# Altium schematic sheet BANK_S_CAPACITORS.SchDoc
size A3; Organization: ICNS, MARCS Institute; Address1: Werrington South Campus, Great Western Highway; Address2: Werrington, NSW, 2747; SheetNumber: 6; SheetTotal: 16
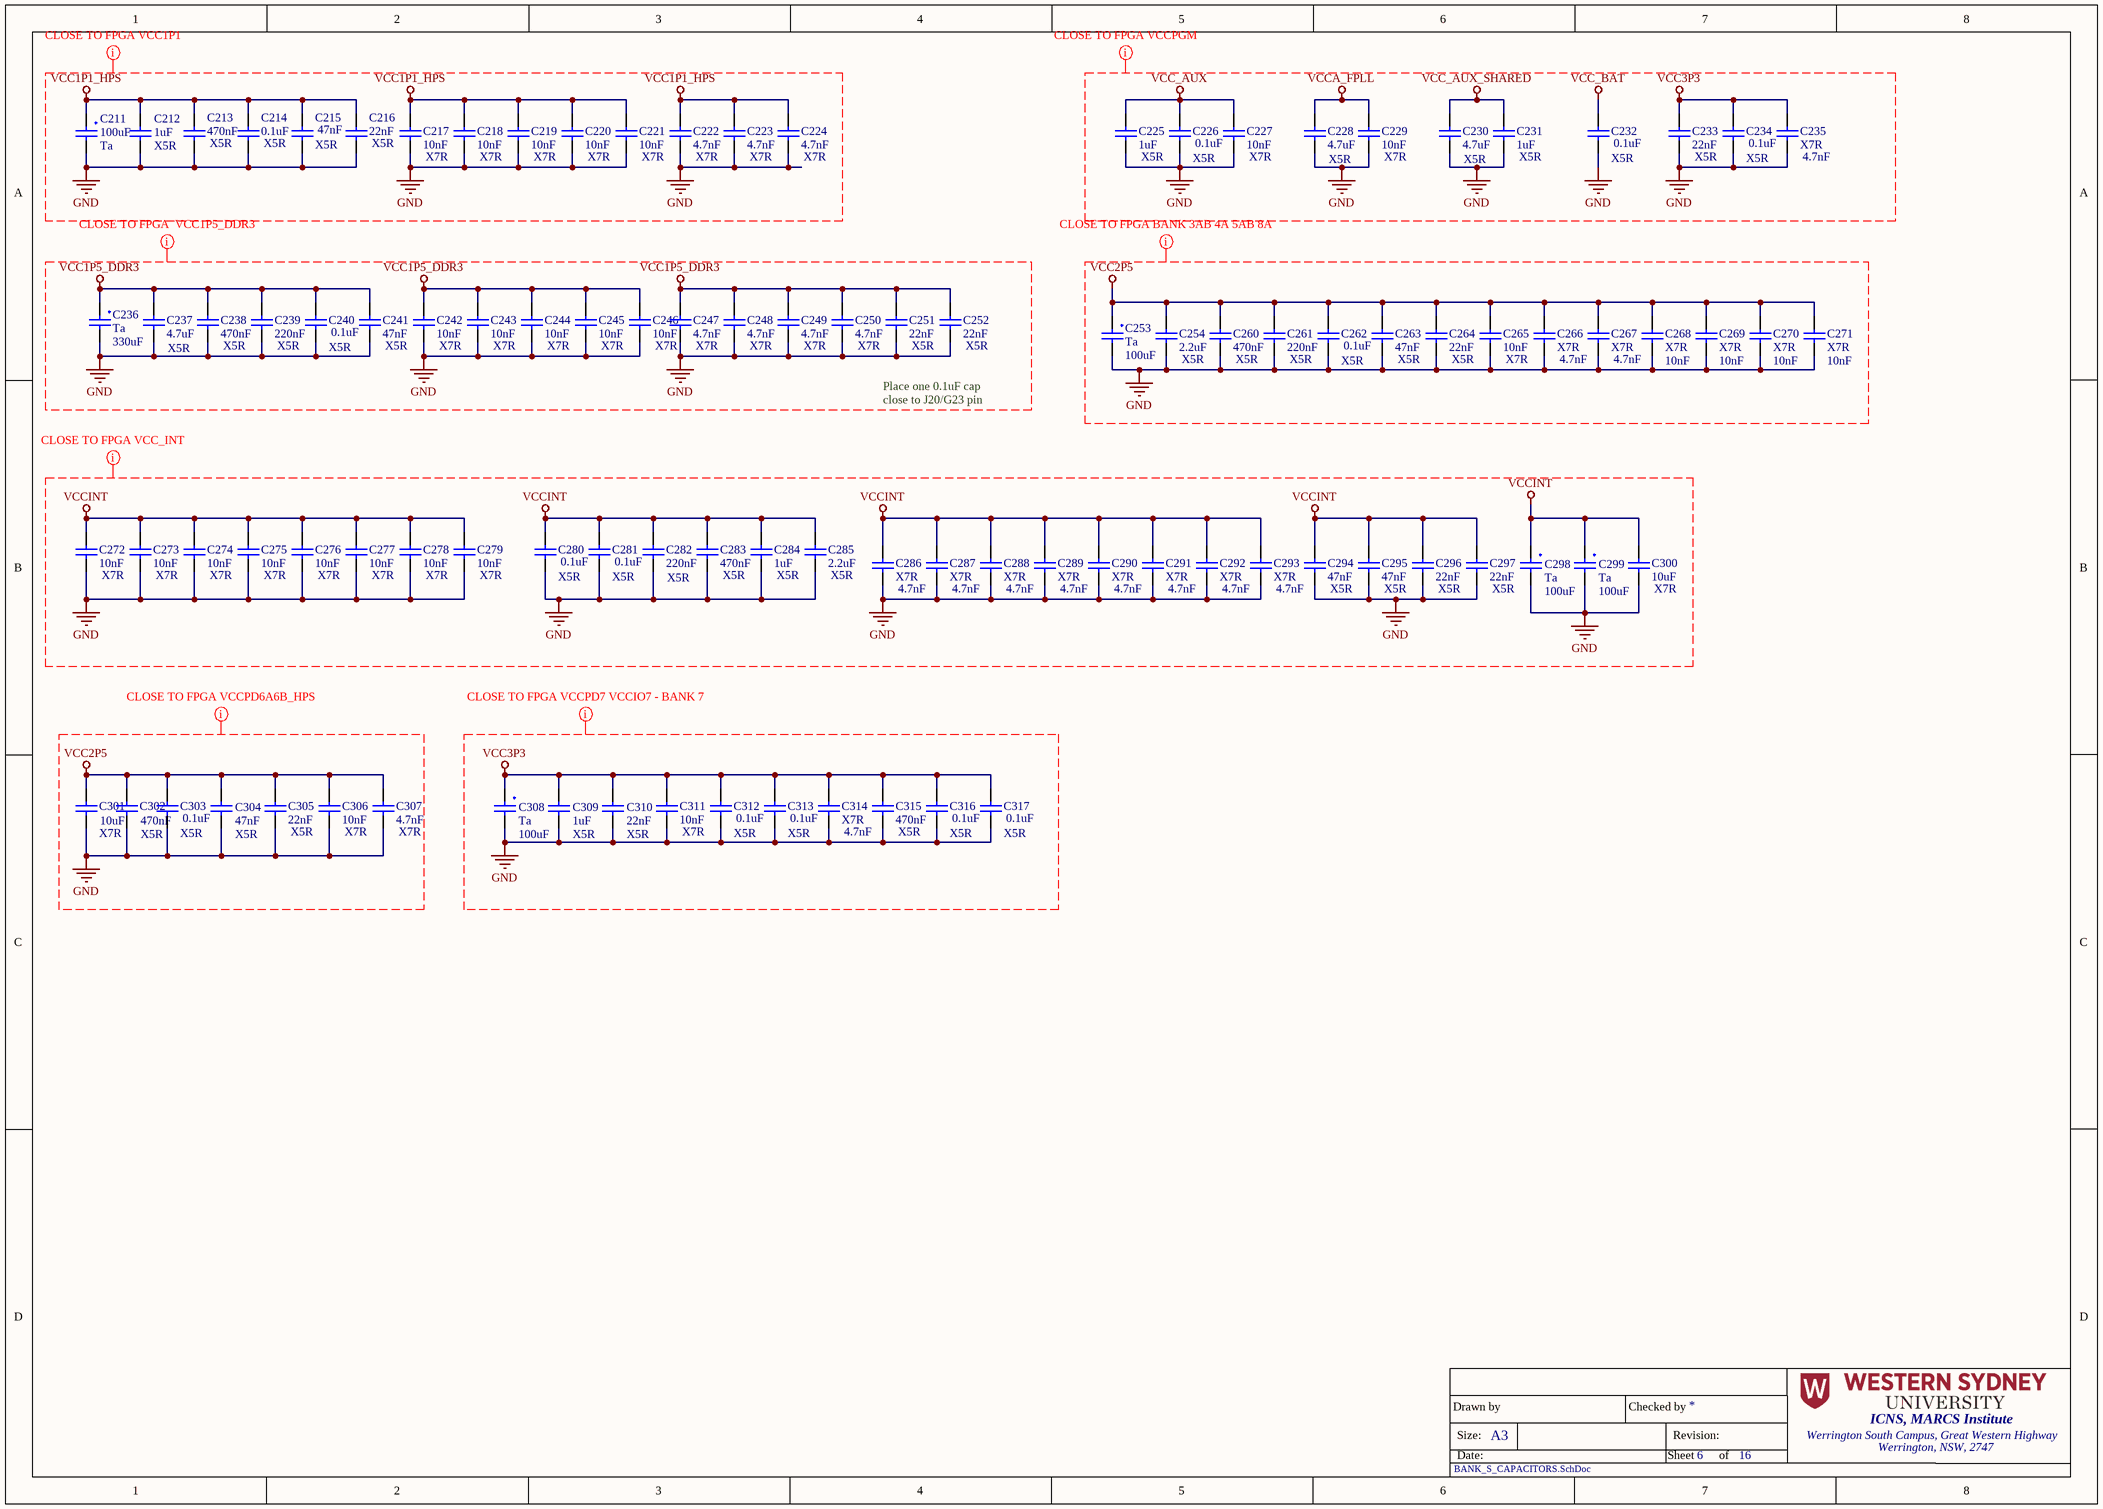
[diagram p0: BANK_S_CAPACITORS.SchDoc]

## Parts
C211  value 100uF  Dielectric: Ta  [CAPCP 0805 (2012)]  (hidden comment: TLCR107M006RTA)
C212  value 1uF  Dielectric: X5R  [CAP 0201 (0603)]  (hidden comment: CL03A105KP3NSNC)
C213  value 470nF  Dielectric: X5R  [CAP 0201 (0603)]  (hidden comment: LMK063BBJ474KPLF)
C214  value 0.1uF  Dielectric: X5R  [CAP 0201 (0603)]  (hidden comment: CL03A104KP3NNNC)
C215  value 47nF  Dielectric: X5R  [CAP 0201 (0603)]  (hidden comment: GRM033R60J473KE19D)
C216  value 22nF  Dielectric: X5R  [CAP 0201 (0603)]  (hidden comment: CC0201KRX5R6BB223)
C217  value 10nF  Dielectric: X7R  [CAP 0201 (0603)]  (hidden comment: GRM033R71A103KA01D)
C218  value 10nF  Dielectric: X7R  [CAP 0201 (0603)]  (hidden comment: GRM033R71A103KA01D)
C219  value 10nF  Dielectric: X7R  [CAP 0201 (0603)]  (hidden comment: GRM033R71A103KA01D)
C220  value 10nF  Dielectric: X7R  [CAP 0201 (0603)]  (hidden comment: GRM033R71A103KA01D)
C221  value 10nF  Dielectric: X7R  [CAP 0201 (0603)]  (hidden comment: GRM033R71A103KA01D)
C222  value 4.7nF  Dielectric: X7R  [CAP 0201 (0603)]  (hidden comment: CC0201KRX7R5BB472)
C223  value 4.7nF  Dielectric: X7R  [CAP 0201 (0603)]  (hidden comment: CC0201KRX7R5BB472)
C224  value 4.7nF  Dielectric: X7R  [CAP 0201 (0603)]  (hidden comment: CC0201KRX7R5BB472)
C225  value 1uF  Dielectric: X5R  [CAP 0201 (0603)]  (hidden comment: CL03A105KP3NSNC)
C226  value 0.1uF  Dielectric: X5R  [CAP 0201 (0603)]  (hidden comment: CL03A104KP3NNNC)
C227  value 10nF  Dielectric: X7R  [CAP 0201 (0603)]  (hidden comment: GRM033R71A103KA01D)
C228  value 4.7uF  Dielectric: X5R  [CAP 0402 (1005)]  (hidden comment: C1005X5R1A475K050BC)
C229  value 10nF  Dielectric: X7R  [CAP 0201 (0603)]  (hidden comment: GRM033R71A103KA01D)
C230  value 4.7uF  Dielectric: X5R  [CAP 0402 (1005)]  (hidden comment: C1005X5R1A475K050BC)
C231  value 1uF  Dielectric: X5R  [CAP 0201 (0603)]  (hidden comment: CL03A105KP3NSNC)
C232  value 0.1uF  Dielectric: X5R  [CAP 0201 (0603)]  (hidden comment: CL03A104KP3NNNC)
C233  value 22nF  Dielectric: X5R  [CAP 0201 (0603)]  (hidden comment: CC0201KRX5R6BB223)
C234  value 0.1uF  Dielectric: X5R  [CAP 0201 (0603)]  (hidden comment: CL03A104KP3NNNC)
C235  Capacitance: 4.7nF  Dielectric: X7R  [CAP 0201 (0603)]  (hidden comment: CC0201KRX7R5BB472)
C236  value 330uF  Dielectric: Ta  [CAPMP7343X31N]  (hidden comment: T495D337K006ATE100)
C237  value 4.7uF  Dielectric: X5R  [CAP 0402 (1005)]  (hidden comment: C1005X5R1A475K050BC)
C238  value 470nF  Dielectric: X5R  [CAP 0201 (0603)]  (hidden comment: LMK063BBJ474KPLF)
C239  value 220nF  Dielectric: X5R  [CAP 0201 (0603)]  (hidden comment: GRM033R61A224KE90D)
C240  value 0.1uF  Dielectric: X5R  [CAP 0201 (0603)]  (hidden comment: CL03A104KP3NNNC)
C241  value 47nF  Dielectric: X5R  [CAP 0201 (0603)]  (hidden comment: GRM033R60J473KE19D)
C242  value 10nF  Dielectric: X7R  [CAP 0201 (0603)]  (hidden comment: GRM033R71A103KA01D)
C243  value 10nF  Dielectric: X7R  [CAP 0201 (0603)]  (hidden comment: GRM033R71A103KA01D)
C244  value 10nF  Dielectric: X7R  [CAP 0201 (0603)]  (hidden comment: GRM033R71A103KA01D)
C245  value 10nF  Dielectric: X7R  [CAP 0201 (0603)]  (hidden comment: GRM033R71A103KA01D)
C246  value 10nF  Dielectric: X7R  [CAP 0201 (0603)]  (hidden comment: GRM033R71A103KA01D)
C247  value 4.7nF  Dielectric: X7R  [CAP 0201 (0603)]  (hidden comment: CC0201KRX7R5BB472)
C248  value 4.7nF  Dielectric: X7R  [CAP 0201 (0603)]  (hidden comment: CC0201KRX7R5BB472)
C249  value 4.7nF  Dielectric: X7R  [CAP 0201 (0603)]  (hidden comment: CC0201KRX7R5BB472)
C250  value 4.7nF  Dielectric: X7R  [CAP 0201 (0603)]  (hidden comment: CC0201KRX7R5BB472)
C251  value 22nF  Dielectric: X5R  [CAP 0201 (0603)]  (hidden comment: CC0201KRX5R6BB223)
C252  value 22nF  Dielectric: X5R  [CAP 0201 (0603)]  (hidden comment: CC0201KRX5R6BB223)
C253  value 100uF  Dielectric: Ta  [CAPCP 0805 (2012)]  (hidden comment: TLCR107M006RTA)
C254  value 2.2uF  Dielectric: X5R  [CAP 0201 (0603)]  (hidden comment: GRM033R61A225KE47J)
C260  value 470nF  Dielectric: X5R  [CAP 0201 (0603)]  (hidden comment: LMK063BBJ474KPLF)
C261  value 220nF  Dielectric: X5R  [CAP 0201 (0603)]  (hidden comment: GRM033R61A224KE90D)
C262  value 0.1uF  Dielectric: X5R  [CAP 0201 (0603)]  (hidden comment: CL03A104KP3NNNC)
C263  value 47nF  Dielectric: X5R  [CAP 0201 (0603)]  (hidden comment: GRM033R60J473KE19D)
C264  value 22nF  Dielectric: X5R  [CAP 0201 (0603)]  (hidden comment: CC0201KRX5R6BB223)
C265  value 10nF  Dielectric: X7R  [CAP 0201 (0603)]  (hidden comment: GRM033R71A103KA01D)
C266  Capacitance: 4.7nF  Dielectric: X7R  [CAP 0201 (0603)]  (hidden comment: CC0201KRX7R5BB472)
C267  Capacitance: 4.7nF  Dielectric: X7R  [CAP 0201 (0603)]  (hidden comment: CC0201KRX7R5BB472)
C268  value 10nF  Dielectric: X7R  [CAP 0201 (0603)]  (hidden comment: GRM033R71A103KA01D)
C269  value 10nF  Dielectric: X7R  [CAP 0201 (0603)]  (hidden comment: GRM033R71A103KA01D)
C270  value 10nF  Dielectric: X7R  [CAP 0201 (0603)]  (hidden comment: GRM033R71A103KA01D)
C271  value 10nF  Dielectric: X7R  [CAP 0201 (0603)]  (hidden comment: GRM033R71A103KA01D)
C272  value 10nF  Dielectric: X7R  [CAP 0201 (0603)]  (hidden comment: GRM033R71A103KA01D)
C273  value 10nF  Dielectric: X7R  [CAP 0201 (0603)]  (hidden comment: GRM033R71A103KA01D)
C274  value 10nF  Dielectric: X7R  [CAP 0201 (0603)]  (hidden comment: GRM033R71A103KA01D)
C275  value 10nF  Dielectric: X7R  [CAP 0201 (0603)]  (hidden comment: GRM033R71A103KA01D)
C276  value 10nF  Dielectric: X7R  [CAP 0201 (0603)]  (hidden comment: GRM033R71A103KA01D)
C277  value 10nF  Dielectric: X7R  [CAP 0201 (0603)]  (hidden comment: GRM033R71A103KA01D)
C278  value 10nF  Dielectric: X7R  [CAP 0201 (0603)]  (hidden comment: GRM033R71A103KA01D)
C279  value 10nF  Dielectric: X7R  [CAP 0201 (0603)]  (hidden comment: GRM033R71A103KA01D)
C280  value 0.1uF  Dielectric: X5R  [CAP 0201 (0603)]  (hidden comment: CL03A104KP3NNNC)
C281  value 0.1uF  Dielectric: X5R  [CAP 0201 (0603)]  (hidden comment: CL03A104KP3NNNC)
C282  value 220nF  Dielectric: X5R  [CAP 0201 (0603)]  (hidden comment: GRM033R61A224KE90D)
C283  value 470nF  Dielectric: X5R  [CAP 0201 (0603)]  (hidden comment: LMK063BBJ474KPLF)
C284  value 1uF  Dielectric: X5R  [CAP 0201 (0603)]  (hidden comment: CL03A105KP3NSNC)
C285  value 2.2uF  Dielectric: X5R  [CAP 0201 (0603)]  (hidden comment: GRM033R61A225KE47J)
C286  Capacitance: 4.7nF  Dielectric: X7R  [CAP 0201 (0603)]  (hidden comment: CC0201KRX7R5BB472)
C287  Capacitance: 4.7nF  Dielectric: X7R  [CAP 0201 (0603)]  (hidden comment: CC0201KRX7R5BB472)
C288  Capacitance: 4.7nF  Dielectric: X7R  [CAP 0201 (0603)]  (hidden comment: CC0201KRX7R5BB472)
C289  Capacitance: 4.7nF  Dielectric: X7R  [CAP 0201 (0603)]  (hidden comment: CC0201KRX7R5BB472)
C290  Capacitance: 4.7nF  Dielectric: X7R  [CAP 0201 (0603)]  (hidden comment: CC0201KRX7R5BB472)
C291  Capacitance: 4.7nF  Dielectric: X7R  [CAP 0201 (0603)]  (hidden comment: CC0201KRX7R5BB472)
C292  Capacitance: 4.7nF  Dielectric: X7R  [CAP 0201 (0603)]  (hidden comment: CC0201KRX7R5BB472)
C293  Capacitance: 4.7nF  Dielectric: X7R  [CAP 0201 (0603)]  (hidden comment: CC0201KRX7R5BB472)
C294  value 47nF  Dielectric: X5R  [CAP 0201 (0603)]  (hidden comment: GRM033R60J473KE19D)
C295  value 47nF  Dielectric: X5R  [CAP 0201 (0603)]  (hidden comment: GRM033R60J473KE19D)
C296  value 22nF  Dielectric: X5R  [CAP 0201 (0603)]  (hidden comment: CC0201KRX5R6BB223)
C297  value 22nF  Dielectric: X5R  [CAP 0201 (0603)]  (hidden comment: CC0201KRX5R6BB223)
C298  value 100uF  Dielectric: Ta  [CAPCP 0805 (2012)]  (hidden comment: TLCR107M006RTA)
C299  value 100uF  Dielectric: Ta  [CAPCP 0805 (2012)]  (hidden comment: TLCR107M006RTA)
C300  value 10uF  Dielectric: X7R  [CAP 0805 (2012)]  (hidden comment: GCM21BR71A106KE22K)
C301  Dielectric: X7R  Capacitance: 10uF  [CAP 0805 (2012)]  (hidden comment: GCM21BR71A106KE22K)
C302  Dielectric: X5R  Capacitance: 470nF  [CAP 0201 (0603)]  (hidden comment: LMK063BBJ474KPLF)
C303  value 0.1uF  Dielectric: X5R  [CAP 0201 (0603)]  (hidden comment: CL03A104KP3NNNC)
C304  value 47nF  Dielectric: X5R  [CAP 0201 (0603)]  (hidden comment: GRM033R60J473KE19D)
C305  value 22nF  Dielectric: X5R  [CAP 0201 (0603)]  (hidden comment: CC0201KRX5R6BB223)
C306  value 10nF  Dielectric: X7R  [CAP 0201 (0603)]  (hidden comment: GRM033R71A103KA01D)
C307  value 4.7nF  Dielectric: X7R  [CAP 0201 (0603)]  (hidden comment: CC0201KRX7R5BB472)
C308  value 100uF  Dielectric: Ta  [CAPCP 0805 (2012)]  (hidden comment: TLCR107M006RTA)
C309  value 1uF  Dielectric: X5R  [CAP 0201 (0603)]  (hidden comment: CL03A105KP3NSNC)
C310  value 22nF  Dielectric: X5R  [CAP 0201 (0603)]  (hidden comment: CC0201KRX5R6BB223)
C311  value 10nF  Dielectric: X7R  [CAP 0201 (0603)]  (hidden comment: GRM033R71A103KA01D)
C312  value 0.1uF  Dielectric: X5R  [CAP 0201 (0603)]  (hidden comment: CL03A104KP3NNNC)
C313  value 0.1uF  Dielectric: X5R  [CAP 0201 (0603)]  (hidden comment: CL03A104KP3NNNC)
C314  Capacitance: 4.7nF  Dielectric: X7R  [CAP 0201 (0603)]  (hidden comment: CC0201KRX7R5BB472)
C315  value 470nF  Dielectric: X5R  [CAP 0201 (0603)]  (hidden comment: LMK063BBJ474KPLF)
C316  value 0.1uF  Dielectric: X5R  [CAP 0201 (0603)]  (hidden comment: CL03A104KP3NNNC)
C317  value 0.1uF  Dielectric: X5R  [CAP 0201 (0603)]  (hidden comment: CL03A104KP3NNNC)

## Nets
GND: C211.2 C212.2 C213.2 C214.2 C215.2 C216.2 C217.2 C218.2 C219.2 C220.2 C221.2 C222.2 C223.2 C224.2 C225.2 C226.2 C227.2 C228.2 C229.2 C230.2 C231.2 C232.2 C233.2 C234.2 C235.2 C236.2 C237.2 C238.2 C239.2 C240.2 C241.2 C242.2 C243.2 C244.2 C245.2 C246.2 C247.2 C248.2 C249.2 C250.2 C251.2 C252.2 C253.2 C254.2 C260.2 C261.2 C262.2 C263.2 C264.2 C265.2 C266.2 C267.2 C268.2 C269.2 C270.2 C271.2 C272.2 C273.2 C274.2 C275.2 C276.2 C277.2 C278.2 C279.2 C280.2 C281.2 C282.2 C283.2 C284.2 C285.2 C286.2 C287.2 C288.2 C289.2 C290.2 C291.2 C292.2 C293.2 C294.2 C295.2 C296.2 C297.2 C298.2 C299.2 C300.2 C301.2 C302.2 C303.2 C304.2 C305.2 C306.2 C307.2 C308.2 C309.2 C310.2 C311.2 C312.2 C313.2 C314.2 C315.2 C316.2 C317.2
VCC1P1_HPS: C211.1 C212.1 C213.1 C214.1 C215.1 C216.1 C217.1 C218.1 C219.1 C220.1 C221.1 C222.1 C223.1 C224.1
VCC1P5_DDR3: C236.1 C237.1 C238.1 C239.1 C240.1 C241.1 C242.1 C243.1 C244.1 C245.1 C246.1 C247.1 C248.1 C249.1 C250.1 C251.1 C252.1
VCC2P5: C253.1 C254.1 C260.1 C261.1 C262.1 C263.1 C264.1 C265.1 C266.1 C267.1 C268.1 C269.1 C270.1 C271.1 C301.1 C302.1 C303.1 C304.1 C305.1 C306.1 C307.1
VCC3P3: C233.1 C234.1 C235.1 C308.1 C309.1 C310.1 C311.1 C312.1 C313.1 C314.1 C315.1 C316.1 C317.1
VCC_AUX: C225.1 C226.1 C227.1
VCC_AUX_SHARED: C230.1 C231.1
VCC_BAT: C232.1
VCCA_FPLL: C228.1 C229.1
VCCINT: C272.1 C273.1 C274.1 C275.1 C276.1 C277.1 C278.1 C279.1 C280.1 C281.1 C282.1 C283.1 C284.1 C285.1 C286.1 C287.1 C288.1 C289.1 C290.1 C291.1 C292.1 C293.1 C294.1 C295.1 C296.1 C297.1 C298.1 C299.1 C300.1

## Layout directives
mark named CLOSE TO FPGA  VCC1P5_DDR3: GND, VCC1P5_DDR3
mark named CLOSE TO FPGA VCC1P1: GND, VCC1P1_HPS
mark named CLOSE TO FPGA VCCPGM: GND, VCC3P3, VCC_AUX, VCC_AUX_SHARED, VCC_BAT, VCCA_FPLL
mark named CLOSE TO FPGA VCC_INT: GND, VCCINT
mark named CLOSE TO FPGA BANK 3AB 4A 5AB 8A: GND, VCC2P5
mark named CLOSE TO FPGA VCCPD6A6B_HPS: GND, VCC2P5
mark named CLOSE TO FPGA VCCPD7 VCCIO7 - BANK 7: GND, VCC3P3

## Notes on the sheet
- Place one 0.1uF cap
  close to J20/G23 pin
- Drawn by
- Size:
- Date:
- A3
- Checked by
- Sheet
- Revision:
- of

## Library data of the parts
C211 = CMP-003-000001-2: Cap Tant Solid 100uF 6.3V R CASE 20% (2 X 1.35 X 1.35mm) SMD 2012-15 5 Ohm 125°C Plastic T/R; Manufacturer 1: Kyocera AVX; Leakage Current: 6uA; ESR (Equivalent Series Resistance): 5R; Width: 0.053inch; Packaging: Tape and Reel; Case Code (Imperial): 0805; Lead Free: Lead Free; Capacitance: 100uF; Features: General Purpose; Package Quantity: 1; RoHS Compliant: Yes; Termination: SMD/SMT; Height - Seated (Max): 0.059inch; Depth: 1.35mm; Max Operating Temperature: 125°C; Series: TLC; Mount: Surface Mount; Voltage Rating: 6.3V; Min Operating Temperature: -55°C; Length: 2mm; Voltage Rating (DC): 6.3V; Radiation Hardening: No; Case/Package: 0805; Construction: Flat; Case Code (Metric): 2012; Tolerance: 20%; Height: 1.5mm; ComponentLink1Description: https://datasheet.ciiva.com/16299/tantniob-16299237.pdf?src-supplier=Future+Electronics; ComponentLink4Description: https://datasheet.ciiva.com/264/tlc-264931.pdf?src-supplier=Digi-Key; ComponentLink2Description: https://datasheet.ciiva.com/17337/tlc-17337857.pdf?src-supplier=Avnet+Europe; Category: Tantalum Capacitors; ComponentLink4URL: https://datasheet.ciiva.com/264/tlc-264931.pdf?src-supplier=Digi-Key; ComponentLink1URL: https://datasheet.ciiva.com/16299/tantniob-16299237.pdf?src-supplier=Future+Electronics; RoHS: Yes; ComponentLink2URL: https://datasheet.ciiva.com/17337/tlc-17337857.pdf?src-supplier=Avnet+Europe; ComponentLink3URL: https://datasheet.ciiva.com/264/tlc-264930.pdf?src-supplier=Digi-Key; Stock 1: 3919; Pricing 1: 1=2.74000, 10=2.21400, 50=1.93200, 100=1.69050, 500=1.28800, 1000=1.12700 (USD); Manufacturer Part Number 1: TLCR107M006RTA; Description 1: Cap Tant Solid 100uF 6.3V R CASE 20% (2 X 1.35 X 1.35mm) SMD 2012-15 5 Ohm 125°C Plastic T/R; Design Item ID: TLCR107M006RTA; Source: ICNS_PropheseeLib.SchLib; ComponentLink3Description: https://datasheet.ciiva.com/264/tlc-264930.pdf?src-supplier=Digi-Key; ComponentLink5URL: https://datasheet.ciiva.com/264/tlc-264932.pdf?src-supplier=Digi-Key; ComponentLink5Description: https://datasheet.ciiva.com/264/tlc-264932.pdf?src-supplier=Digi-Key; ComponentLink6Description: https://datasheet.ciiva.com/12882/tlc-4380-12882614.pdf?src-supplier=Mouser; ComponentLink6URL: https://datasheet.ciiva.com/12882/tlc-4380-12882614.pdf?src-supplier=Mouser
C212 C225 C231 C284 C309 = CMP-003-000015-1: Cap Ceramic 1uF 10V X5R 10% Pad SMD 0201 85C T/R; Manufacturer: Samsung; Capacitance: 1uF; Max Operating Temperature: 85°C; Packaging: Cut Tape; Voltage Rating: 10V; Min Operating Temperature: -55°C; Case/Package: 0201; Tolerance: 10%; Length: 0.024inch; Case Code (Imperial): 0201; Case Code (Metric): 0603; Width: 0.012inch; Mount: Surface Mount; Thickness: 0.013inch; RoHS: Yes; ComponentLink1URL: http://www.samsungsem.com/kr/support/product-search/mlcc/CL03A105KP3NSNC.jsp?src-supplier=Digi-Key; ComponentLink1Description: http://www.samsungsem.com/kr/support/product-search/mlcc/CL03A105KP3NSNC.jsp?src-supplier=Digi-Key; Category: Ceramic Capacitors; Stock 1: 3449211; Source: ICNS_PropheseeLib.SchLib; Pricing 1: 10000=0.06202, 20000=0.05883 (USD); Design Item ID: CL03A105KP3NSNC; Manufacturer Part Number: CL03A105KP3NSNC; RoHS Compliant: Yes
C213 C238 C260 C283 C315 = CMP-003-000027-1: Cap Multilayer Ceramic 0.47 uF 10V X5R  0201 10% RoHS  (High dielectric type); Manufacturer: Taiyo Yuden; Case Code (Imperial): 0201; Voltage Rating (DC): 10V; RoHS Compliant: Yes; Capacitance: 470nF; Pricing 1: 1=0.22500, 25=0.09300, 100=0.07600, 250=0.06500, 500=0.05400, 1000=0.04400 (USD); Manufacturer Part Number: LMK063BBJ474KPLF; RoHS: Yes; Source: ICNS_PropheseeLib.SchLib; ComponentLink1Description: http://www.farnell.com/datasheets/2820091.pdf?src-supplier=Farnell; Design Item ID: LMK063BBJ474KPLF; Category: Ceramic Capacitors; ComponentLink1URL: http://www.farnell.com/datasheets/2820091.pdf?src-supplier=Farnell; Stock 1: 12200
C214 C226 C232 C234 C240 C262 C280 C281 C303 C312 C313 C316 C317 = CMP-003-000014-1: Cap Ceramic 0.1uF 10V X5R 10% Pad SMD 0201 85C T/R; Manufacturer: Samsung; Capacitance: 100nF; Case Code (Imperial): 0201; Voltage Rating (DC): 10V; Manufacturer Part Number: CL03A104KP3NNNC; Stock 1: 12175; Pricing 1: 1=0.10000, 10=0.02900, 50=0.01600, 100=0.01300, 500=0.00932, 1000=0.00732, 2500=0.00666, 5000=0.00612 (USD); ComponentLink1URL: https://datasheet.ciiva.com/25803/cl03a104kp3nnnc-25803204.pdf?src-supplier=Digi-Key; ComponentLink1Description: https://datasheet.ciiva.com/25803/cl03a104kp3nnnc-25803204.pdf?src-supplier=Digi-Key; RoHS: Yes; Source: ICNS_PropheseeLib.SchLib; Design Item ID: CL03A104KP3NNNC; Category: Ceramic Capacitors; Voltage Rating: 10V; Tolerance: 10%; Depth: 0.3mm; Mount: Surface Mount; Package Quantity: 1; Packaging: Tape and Reel; Case Code (Metric): 0603; Lead Free: Lead Free; Width: 0.012inch; Length: 0.6mm; Radiation Hardening: No; Height: 0.3mm; Series: CL; Thickness: 0.013inch; ComponentLink2Description: https://datasheet.ciiva.com/26838/getdatasheetpartid-357484-26838083.pdf?src-supplier=Verical; Max Operating Temperature: 85°C; ComponentLink2URL: https://datasheet.ciiva.com/26838/getdatasheetpartid-357484-26838083.pdf?src-supplier=Verical; Case/Package: 0201; Contact Plating: Tin; Min Operating Temperature: -55°C; Construction: Flat
C215 C241 C263 C294 C295 C304 = CMP-003-000019-1: Cap Multilayer Ceramic 47nF 6.3V X5R SMT 0201±10% Tolerance; Manufacturer: Murata; Tolerance: 10%; Capacitance: 47nF; ComponentLink2URL: https://datasheet.ciiva.com/18184/getdatasheetpartid-223883-18184048.pdf?src-supplier=Verical; Category: Ceramic Capacitors; Voltage Rating: 6.3V; Lead Free: Lead Free; Height: 0.3mm; ComponentLink2Description: https://datasheet.ciiva.com/18184/getdatasheetpartid-223883-18184048.pdf?src-supplier=Verical; RoHS: Yes; Manufacturer Part Number: GRM033R60J473KE19D; Case Code (Imperial): 0201; Source: ICNS_PropheseeLib.SchLib; Depth: 0.3mm; Mount: Surface Mount; Stock 1: 134562; Package Quantity: 15000; Packaging: Tape and Reel; ComponentLink1Description: https://datasheet.ciiva.com/6270/product-6270930.pdf?src-supplier=Digi-Key; Case Code (Metric): 0603; Width: 0.012inch; Length: 0.6mm; Radiation Hardening: No; Series: GRM; Thickness: 0.013inch; Max Operating Temperature: 85°C; Design Item ID: GRM033R60J473KE19D; Voltage Rating (DC): 6.3V; Case/Package: 0201; Min Operating Temperature: -55°C; Construction: Flat; Pricing 1: 1=0.10000, 10=0.05900, 50=0.03240, 100=0.02640, 500=0.01886, 1000=0.01482, 2500=0.01348, 5000=0.01240 (USD); ComponentLink1URL: https://datasheet.ciiva.com/6270/product-6270930.pdf?src-supplier=Digi-Key; ComponentLink3URL: https://datasheet.ciiva.com/29199/455678-da-01-en-vs-kondensator-0201-29199271.pdf?src-supplier=Conrad; RoHS Compliant: Yes; REACH SVHC: No SVHC; ComponentLink3Description: https://datasheet.ciiva.com/29199/455678-da-01-en-vs-kondensator-0201-29199271.pdf?src-supplier=Conrad; Material: Ceramic; Termination: SMD/SMT
C216 C233 C251 C252 C264 C296 C297 C305 C310 = CMP-003-000017-2: Cap Multilayer Ceramic 22nF 10V X5R 0201 ±10% Tolerance; Manufacturer: Yageo; Width: 0.012inch; Mount: Surface Mount; Capacitance: 22nF; Voltage Rating (DC): 10V; Voltage Rating: 10V; Length: 0.024inch; Packaging: Tape and Reel; Case/Package: 0201; Tolerance: 10%; Min Operating Temperature: -55°C; Lead Free: Lead Free; Thickness: 0.013inch; Max Operating Temperature: 85°C; Design Item ID: CC0201KRX5R6BB223; Stock 1: 314711; Source: ICNS_PropheseeLib.SchLib; ComponentLink1URL: http://www.yageo.com/exep/pages/download/literatures/ProductSelectionGuide%202014_Final_2.pdf?src-supplier=Digi-Key; RoHS: Yes; RoHS Compliant: Yes; Pricing 1: 1=0.10000, 10=0.02400, 50=0.01320, 100=0.01080, 500=0.00770, 1000=0.00605, 2500=0.00550, 5000=0.00506 (USD); Manufacturer Part Number: CC0201KRX5R6BB223; ComponentLink1Description: http://www.yageo.com/exep/pages/download/literatures/ProductSelectionGuide%202014_Final_2.pdf?src-supplier=Digi-Key; Category: Ceramic Capacitors; Case Code Imperial: 0201; Halogen Free: Halogen Free
C217-C221 C227 C229 C242-C246 C265 C268-C279 C306 C311 = CMP-003-000022-2: Cap Multilayer Ceramic 10nF 10V X7R 0201 ±10 % Tolerance SMT; Manufacturer: Murata; Tolerance: 10%; Package Quantity: 1; Width: 0.012inch; Voltage: 10V; Mount: Surface Mount; Capacitance: 10nF; Voltage Rating (DC): 10V; Voltage Rating: 10V; Length: 0.6mm; Packaging: Tape and Reel; Material: Ceramic; REACH SVHC: No SVHC; Termination: SMD/SMT; Case/Package: 0201; Radiation Hardening: No; Height: 0.3mm; Case Code (Imperial): 0201; Min Operating Temperature: -55°C; Lead Free: Lead Free; Thickness: 0.013inch; Depth: 0.3mm; Case Code (Metric): 0603; Max Operating Temperature: 125°C; Design Item ID: GRM033R71A103KA01D; ComponentLink3URL: https://datasheet.ciiva.com/11789/0900766b80ef921d-11789049.pdf?src-supplier=RSComponents; Stock 1: 6245; ComponentLink2URL: https://datasheet.ciiva.com/129/grm033r71a103ka01-01-129815.pdf?src-supplier=Digi-Key; Source: ICNS_PropheseeLib.SchLib; ComponentLink1URL: https://datasheet.ciiva.com/129/grm033r71a103ka01-01-129814.pdf?src-supplier=Digi-Key; ComponentLink4URL: https://datasheet.ciiva.com/16467/product-16467346.pdf?src-supplier=Future+Electronics; RoHS: Yes; RoHS Compliant: Yes; ComponentLink3Description: https://datasheet.ciiva.com/11789/0900766b80ef921d-11789049.pdf?src-supplier=RSComponents; ComponentLink5URL: https://datasheet.ciiva.com/18184/getdatasheetpartid-158821-18184066.pdf?src-supplier=Verical; ComponentLink7Description: https://datasheet.ciiva.com/5422/product-5422667.pdf?src-supplier=Mouser; Pricing 1: 1=0.10000, 10=0.02000, 50=0.01060, 100=0.00870, 500=0.00624, 1000=0.00490, 2500=0.00446, 5000=0.00410 (USD); Manufacturer Part Number: GRM033R71A103KA01D; ComponentLink1Description: https://datasheet.ciiva.com/129/grm033r71a103ka01-01-129814.pdf?src-supplier=Digi-Key; ComponentLink5Description: https://datasheet.ciiva.com/18184/getdatasheetpartid-158821-18184066.pdf?src-supplier=Verical; ComponentLink7URL: https://datasheet.ciiva.com/5422/product-5422667.pdf?src-supplier=Mouser; ComponentLink2Description: https://datasheet.ciiva.com/129/grm033r71a103ka01-01-129815.pdf?src-supplier=Digi-Key; Category: Ceramic Capacitors; ComponentLink6URL: https://datasheet.ciiva.com/29199/455719-da-01-en-vs-kondensator-0201-29199284.pdf?src-supplier=Conrad; ComponentLink4Description: https://datasheet.ciiva.com/16467/product-16467346.pdf?src-supplier=Future+Electronics; ComponentLink6Description: https://datasheet.ciiva.com/29199/455719-da-01-en-vs-kondensator-0201-29199284.pdf?src-supplier=Conrad
C222-C224 C235 C247-C250 C266 C267 C286-C293 C307 C314 = CMP-003-000018-1: Cap Ceramic 4.7nF 6.3V X7R 10% Pad SMD 0201 125C Automotive T/R; Manufacturer: Yageo; Package Quantity: 1; Width: 0.012inch; Mount: Surface Mount; Voltage Rating (DC): 6.3V; Voltage Rating: 6.3V; Length: 0.024inch; Packaging: Tape and Reel; Termination: SMD/SMT; Case/Package: 0201; Tolerance: 10%; Case Code (Imperial): 0201; Min Operating Temperature: -55°C; Lead Free: Lead Free; Thickness: 0.013inch; Case Code (Metric): 0603; Max Operating Temperature: 125°C; Design Item ID: CC0201KRX7R5BB472; ComponentLink3URL: https://datasheet.ciiva.com/176/mlccorderingcode-176531.pdf?src-supplier=Digi-Key; Stock 1: 3450; ComponentLink2URL: https://datasheet.ciiva.com/176/mlccorderingcode-176533.pdf?src-supplier=Digi-Key; Source: ICNS_PropheseeLib.SchLib; ComponentLink1URL: https://datasheet.ciiva.com/176/mlccorderingcode-176532.pdf?src-supplier=Digi-Key; RoHS: Yes; RoHS Compliant: Yes; ComponentLink3Description: https://datasheet.ciiva.com/176/mlccorderingcode-176531.pdf?src-supplier=Digi-Key; Pricing 1: 1=0.10000, 10=0.02400, 50=0.01320, 100=0.01080, 500=0.00770, 1000=0.00605, 2500=0.00550, 5000=0.00506 (USD); Manufacturer Part Number: CC0201KRX7R5BB472; ComponentLink1Description: https://datasheet.ciiva.com/176/mlccorderingcode-176532.pdf?src-supplier=Digi-Key; ComponentLink2Description: https://datasheet.ciiva.com/176/mlccorderingcode-176533.pdf?src-supplier=Digi-Key; Category: Ceramic Capacitors; Series: CC; Resistor Type: Ceramic; Halogen Free: Halogen Free; Weight: 6E-06oz
  C222-C224 C247-C250 C307: Capacitance: 4.7nF
  C235 C266 C267 C286-C293 C314: Value: 4.7nF
C228 C230 C237 = CMP-003-000024-1: Cap Multilayer Ceramic 4.7uF 10 V X5R ±10 % SMT 0402  C Series; Manufacturer: TDK; Voltage Rating: 10V; Tolerance: 10%; Capacitance: 4.7uF; Max Operating Temperature: 85°C; Packaging: Cut Tape; Min Operating Temperature: -55°C; Case/Package: 0402; Voltage Rating (DC): 10V; Length: 0.039inch; Case Code (Imperial): 0402; Case Code (Metric): 1005; Width: 0.02inch; Mount: Surface Mount; Thickness: 0.022inch; Package Quantity: 10000; RoHS: Yes; ComponentLink1URL: https://datasheet.ciiva.com/14895/tdkmlcccaprange-14895670.pdf?src-supplier=Digi-Key; ComponentLink3Description: https://datasheet.ciiva.com/14895/tdkmlcccaprange-14895672.pdf?src-supplier=Digi-Key; REACH SVHC: No SVHC; Lead Free: Lead Free; ComponentLink1Description: https://datasheet.ciiva.com/14895/tdkmlcccaprange-14895670.pdf?src-supplier=Digi-Key; Category: Ceramic Capacitors; Series: C; ComponentLink2Description: https://datasheet.ciiva.com/14895/tdkmlcccaprange-14895671.pdf?src-supplier=Digi-Key; ComponentLink3URL: https://datasheet.ciiva.com/14895/tdkmlcccaprange-14895672.pdf?src-supplier=Digi-Key; Stock 1: 490145; Source: ICNS_PropheseeLib.SchLib; Pricing 1: 1=0.48000, 10=0.33000, 50=0.23100, 100=0.19800, 500=0.14850, 1000=0.12540, 2500=0.11880, 5000=0.11220 (USD); Design Item ID: C1005X5R1A475K050BC; Dielectric Material: Ceramic; Manufacturer Part Number: C1005X5R1A475K050BC; ComponentLink2URL: https://datasheet.ciiva.com/14895/tdkmlcccaprange-14895671.pdf?src-supplier=Digi-Key
C236 = CMP-003-000008-1: Cap Tant Solid 330uF 6.3V D CASE 10% (7.3 X 4.3 X 2.8mm) SMD 7343-31 0.1 Ohm 125 C T/R; Manufacturer 1: KEMET; Polarity: Polar; Dielectric Material: Tantalum; Dissipation Factor: 8%; Leakage Current: 20.8uA; Life (Hours): 2000Hour; Ripple Current: 490mA; ESR (Equivalent Series Resistance): 100mR; Tolerance: 20%; Width: 0.169inch; Packaging: Tape and Reel; Number of Pins: 2; Case Code (Imperial): 2917; Lead Free: Lead Free; Capacitance: 330uF; Features: General Purpose; REACH SVHC: No SVHC; Package Quantity: 1; RoHS Compliant: Yes; Termination: SMD/SMT; Height - Seated (Max): 0.122inch; Voltage: 6.3V; Depth: 4.3mm; Max Operating Temperature: 125°C; Series: T495; Mount: Surface Mount,PCB; Voltage Rating: 6.3V; Min Operating Temperature: -55°C; Length: 7.3mm; Voltage Rating (DC): 6.3V; Lead Pitch: 3.8mm; Radiation Hardening: No; Case/Package: 7343-31; Construction: Flat; Case Code (Metric): 7343; Height: 2.8mm; ComponentLink1Description: https://datasheet.ciiva.com/3006/kem-t2009-t495-3006066.pdf?src-supplier=Avnet; ComponentLink4Description: https://datasheet.ciiva.com/22698/1881875-22698950.pdf?src-supplier=Element14; ComponentLink2Description: https://datasheet.ciiva.com/18096/getdatasheetpartid-131544-18096133.pdf?src-supplier=Verical; Category: Tantalum Capacitors; ComponentLink4URL: https://datasheet.ciiva.com/22698/1881875-22698950.pdf?src-supplier=Element14; ComponentLink1URL: https://datasheet.ciiva.com/3006/kem-t2009-t495-3006066.pdf?src-supplier=Avnet; RoHS: Yes; ComponentLink2URL: https://datasheet.ciiva.com/18096/getdatasheetpartid-131544-18096133.pdf?src-supplier=Verical; ComponentLink3URL: https://datasheet.ciiva.com/14603/70095916-14603941.pdf?src-supplier=Allied+Electronics; Stock 1: 2500; Pricing 1: 1=2.57000, 10=2.07900, 50=1.81480, 100=1.58790 (USD); Manufacturer Part Number 1: T495D337K006ATE100; Description 1: Cap Tant Solid 330uF 6.3V D CASE 10% (7.3 X 4.3 X 2.8mm) SMD 7343-31 0.1 Ohm 125 C T/R; Design Item ID: T495D337K006ATE100; Source: ICNS_PropheseeLib.SchLib; ComponentLink3Description: https://datasheet.ciiva.com/14603/70095916-14603941.pdf?src-supplier=Allied+Electronics
C239 C261 C282 = CMP-003-000020-1: Cap Multilayer Ceramic 220nF 10V X5R 0201 ±10% Tolerance; Manufacturer: Murata; Case Code (Imperial): 0201; Voltage Rating (DC): 10V; RoHS Compliant: Yes; Capacitance: 220nF; Manufacturer Part Number: GRM033R61A224KE90D; Stock 1: 391; Pricing 1: 1=0.10000, 10=0.03600, 50=0.01980, 100=0.01620, 500=0.01156, 1000=0.00908, 2500=0.00825, 5000=0.00759 (USD); ComponentLink1URL: http://www.farnell.com/datasheets/2867835.pdf?src-supplier=Farnell; ComponentLink1Description: http://www.farnell.com/datasheets/2867835.pdf?src-supplier=Farnell; RoHS: Yes; Source: ICNS_PropheseeLib.SchLib; Design Item ID: GRM033R61A224KE90D; Category: Ceramic Capacitors; Voltage Rating: 10V; ComponentLink2Description: http://www.mouser.com/ds/2/281/c02e-2905.pdf?src-supplier=Mouser; ComponentLink3URL: http://search.murata.co.jp/Ceramy/image/img/A01X/G101/ENG/GRM033R61A224KE90-01.pdf?src-supplier=Digi-Key; Thickness: 0.013inch; Width: 0.012inch; ComponentLink2URL: http://www.mouser.com/ds/2/281/c02e-2905.pdf?src-supplier=Mouser; Case/Package: 0201; ComponentLink4Description: http://www.farnell.com/datasheets/2867835.pdf?src-supplier=Newark; Length: 0.024inch; ComponentLink3Description: http://search.murata.co.jp/Ceramy/image/img/A01X/G101/ENG/GRM033R61A224KE90-01.pdf?src-supplier=Digi-Key; Case Code (Metric): 0603; Tolerance: 10%; Packaging: Tape and Reel; Max Operating Temperature: 85°C; Min Operating Temperature: -55°C; ComponentLink4URL: http://www.farnell.com/datasheets/2867835.pdf?src-supplier=Newark; Mount: Surface Mount
C253 C298 C299 C308 = CMP-003-000001-2: Cap Tant Solid 100uF 6.3V R CASE 20% (2 X 1.35 X 1.35mm) SMD 2012-15 5 Ohm 125°C Plastic T/R; Manufacturer 1: Kyocera AVX; ESR (Equivalent Series Resistance): 5R; Leakage Current: 6uA; Construction: Flat; Length: 2mm; Case/Package: 0805; Voltage Rating (DC): 6.3V; Series: TLC; Max Operating Temperature: 125°C; Tolerance: 20%; Min Operating Temperature: -55°C; Mount: Surface Mount; Width: 0.053inch; Depth: 1.35mm; Case Code (Imperial): 0805; Termination: SMD/SMT; Features: General Purpose; Voltage Rating: 6.3V; Case Code (Metric): 2012; Radiation Hardening: No; Capacitance: 100uF; Package Quantity: 1; RoHS Compliant: Yes; Height: 1.5mm; Packaging: Tape and Reel; Height - Seated (Max): 0.059inch; ComponentLink5URL: https://datasheet.ciiva.com/264/tlc-264932.pdf?src-supplier=Digi-Key; ComponentLink5Description: https://datasheet.ciiva.com/264/tlc-264932.pdf?src-supplier=Digi-Key; ComponentLink1Description: https://datasheet.ciiva.com/16299/tantniob-16299237.pdf?src-supplier=Future+Electronics; ComponentLink3Description: https://datasheet.ciiva.com/264/tlc-264930.pdf?src-supplier=Digi-Key; Stock 1: 3919; ComponentLink4URL: https://datasheet.ciiva.com/264/tlc-264931.pdf?src-supplier=Digi-Key; Pricing 1: 1=2.74000, 10=2.21400, 50=1.93200, 100=1.69050, 500=1.28800, 1000=1.12700 (USD); ComponentLink2Description: https://datasheet.ciiva.com/17337/tlc-17337857.pdf?src-supplier=Avnet+Europe; ComponentLink3URL: https://datasheet.ciiva.com/264/tlc-264930.pdf?src-supplier=Digi-Key; RoHS: Yes; ComponentLink4Description: https://datasheet.ciiva.com/264/tlc-264931.pdf?src-supplier=Digi-Key; Manufacturer Part Number 1: TLCR107M006RTA; Source: ICNS_PropheseeLib.SchLib; ComponentLink6Description: https://datasheet.ciiva.com/12882/tlc-4380-12882614.pdf?src-supplier=Mouser; Description 1: Cap Tant Solid 100uF 6.3V R CASE 20% (2 X 1.35 X 1.35mm) SMD 2012-15 5 Ohm 125°C Plastic T/R; Lead Free: Lead Free; ComponentLink1URL: https://datasheet.ciiva.com/16299/tantniob-16299237.pdf?src-supplier=Future+Electronics; Category: Tantalum Capacitors; ComponentLink2URL: https://datasheet.ciiva.com/17337/tlc-17337857.pdf?src-supplier=Avnet+Europe; ComponentLink6URL: https://datasheet.ciiva.com/12882/tlc-4380-12882614.pdf?src-supplier=Mouser; Design Item ID: TLCR107M006RTA
C254 C285 = CMP-003-000021-1: Cap Ceramic 2.2uF 10VDC X5R 10% SMD 0201 Paper T/R  Monolithic; Manufacturer: Murata; Voltage Rating: 10V; Capacitance: 2.2uF; ComponentLink1URL: https://search.murata.co.jp/Ceramy/image/img/A01X/G101/ENG/GRM033R61A225KE47-04A.pdf?src-supplier=Digi-Key; Case Code Imperial: 0201; Source: ICNS_PropheseeLib.SchLib; Pricing 1: 1=0.29000, 10=0.20000, 50=0.11980, 100=0.10120, 500=0.06922, 1000=0.06123, 2500=0.05856, 5000=0.05324 (USD); RoHS: Yes; Manufacturer Part Number: GRM033R61A225KE47J; Design Item ID: GRM033R61A225KE47J; Category: Ceramic Capacitors; ComponentLink1Description: https://search.murata.co.jp/Ceramy/image/img/A01X/G101/ENG/GRM033R61A225KE47-04A.pdf?src-supplier=Digi-Key; Stock 1: 25152; RoHS Compliant: Yes
C300 = CMP-003-000011-1: 0805 10 uF 10 V ±10 % Tolerance X7R Surface Mount Multilayer Ceramic Capacitor; Manufacturer: Murata; Tolerance: 10%; Voltage Rating: 10V; Mount: Surface Mount; Capacitance: 10uF; Width: 1.25mm; Length: 0.079inch; Case Code (Imperial): 0805; Voltage Rating (DC): 10V; Max Operating Temperature: 125°C; Thickness: 0.055inch; Min Operating Temperature: -55°C; Packaging: Tape and Reel; Case/Package: 0805; Case Code (Metric): 2012; Category: Ceramic Capacitors; Height: 1.25mm; Design Item ID: GCM21BR71A106KE22K; Ratings: AEC-Q200; RoHS: Yes; ComponentLink3URL: http://search.murata.co.jp/Ceramy/image/img/A01X/partnumbering_e_02.pdf?src-supplier=Digi-Key; Weight: 0.000335oz; Package Quantity: 10000; ComponentLink4Description: http://search.murata.co.jp/Ceramy/image/img/A01X/G101/ENG/GCM21BR71A106KE22-01.pdf?src-supplier=Digi-Key; RoHS Compliant: Yes; Manufacturer Part Number: GCM21BR71A106KE22K; ComponentLink1URL: http://www.mouser.com/ds/2/281/c03e-806517.pdf?src-supplier=Mouser; ComponentLink1Description: http://www.mouser.com/ds/2/281/c03e-806517.pdf?src-supplier=Mouser; ComponentLink2Description: https://search.murata.co.jp/Ceramy/image/img/A01X/G101/ENG/GCM21BR71A106KE22-01.pdf?src-supplier=Digi-Key; ComponentLink2URL: https://search.murata.co.jp/Ceramy/image/img/A01X/G101/ENG/GCM21BR71A106KE22-01.pdf?src-supplier=Digi-Key; Source: ICNS_PropheseeLib.SchLib; Pricing: 1=0.45000, 10=0.31600, 50=0.23880, 100=0.20790, 500=0.15400, 1000=0.13090, 2500=0.12320, 5000=0.11550 (USD); Stock: 4655; ComponentLink4URL: http://search.murata.co.jp/Ceramy/image/img/A01X/G101/ENG/GCM21BR71A106KE22-01.pdf?src-supplier=Digi-Key; Termination: SMD/SMT; ComponentLink3Description: http://search.murata.co.jp/Ceramy/image/img/A01X/partnumbering_e_02.pdf?src-supplier=Digi-Key
C301 = CMP-003-000011-1: 0805 10 uF 10 V ±10 % Tolerance X7R Surface Mount Multilayer Ceramic Capacitor; Manufacturer: Murata; Voltage Rating: 10V; Value: 10uF; Tolerance: 10%; Case Code (Imperial): 0805; Category: Ceramic Capacitors; Height: 1.25mm; Mount: Surface Mount; Design Item ID: GCM21BR71A106KE22K; Voltage Rating (DC): 10V; Case Code (Metric): 2012; Ratings: AEC-Q200; RoHS: Yes; Case/Package: 0805; ComponentLink3URL: http://search.murata.co.jp/Ceramy/image/img/A01X/partnumbering_e_02.pdf?src-supplier=Digi-Key; Weight: 0.000335oz; Package Quantity: 10000; ComponentLink4Description: http://search.murata.co.jp/Ceramy/image/img/A01X/G101/ENG/GCM21BR71A106KE22-01.pdf?src-supplier=Digi-Key; Max Operating Temperature: 125°C; RoHS Compliant: Yes; Thickness: 0.055inch; Manufacturer Part Number: GCM21BR71A106KE22K; Packaging: Tape and Reel; Width: 1.25mm; ComponentLink1URL: http://www.mouser.com/ds/2/281/c03e-806517.pdf?src-supplier=Mouser; ComponentLink1Description: http://www.mouser.com/ds/2/281/c03e-806517.pdf?src-supplier=Mouser; ComponentLink2Description: https://search.murata.co.jp/Ceramy/image/img/A01X/G101/ENG/GCM21BR71A106KE22-01.pdf?src-supplier=Digi-Key; ComponentLink2URL: https://search.murata.co.jp/Ceramy/image/img/A01X/G101/ENG/GCM21BR71A106KE22-01.pdf?src-supplier=Digi-Key; Source: ICNS_PropheseeLib.SchLib; Pricing: 1=0.45000, 10=0.31600, 50=0.23880, 100=0.20790, 500=0.15400, 1000=0.13090, 2500=0.12320, 5000=0.11550 (USD); Length: 0.079inch; Stock: 4655; ComponentLink4URL: http://search.murata.co.jp/Ceramy/image/img/A01X/G101/ENG/GCM21BR71A106KE22-01.pdf?src-supplier=Digi-Key; Termination: SMD/SMT; ComponentLink3Description: http://search.murata.co.jp/Ceramy/image/img/A01X/partnumbering_e_02.pdf?src-supplier=Digi-Key; Min Operating Temperature: -55°C
C302 = CMP-003-000027-1: Cap Multilayer Ceramic 0.47 uF 10V X5R  0201 10% RoHS  (High dielectric type); Manufacturer: Taiyo Yuden; Value: 470nF; Pricing 1: 1=0.22500, 25=0.09300, 100=0.07600, 250=0.06500, 500=0.05400, 1000=0.04400 (USD); Manufacturer Part Number: LMK063BBJ474KPLF; RoHS: Yes; Source: ICNS_PropheseeLib.SchLib; Voltage Rating (DC): 10V; ComponentLink1Description: http://www.farnell.com/datasheets/2820091.pdf?src-supplier=Farnell; Case Code (Imperial): 0201; Design Item ID: LMK063BBJ474KPLF; Category: Ceramic Capacitors; ComponentLink1URL: http://www.farnell.com/datasheets/2820091.pdf?src-supplier=Farnell; Stock 1: 12200; RoHS Compliant: Yes